# EAGLE board nest_interface_b (EAGLE 6.3)
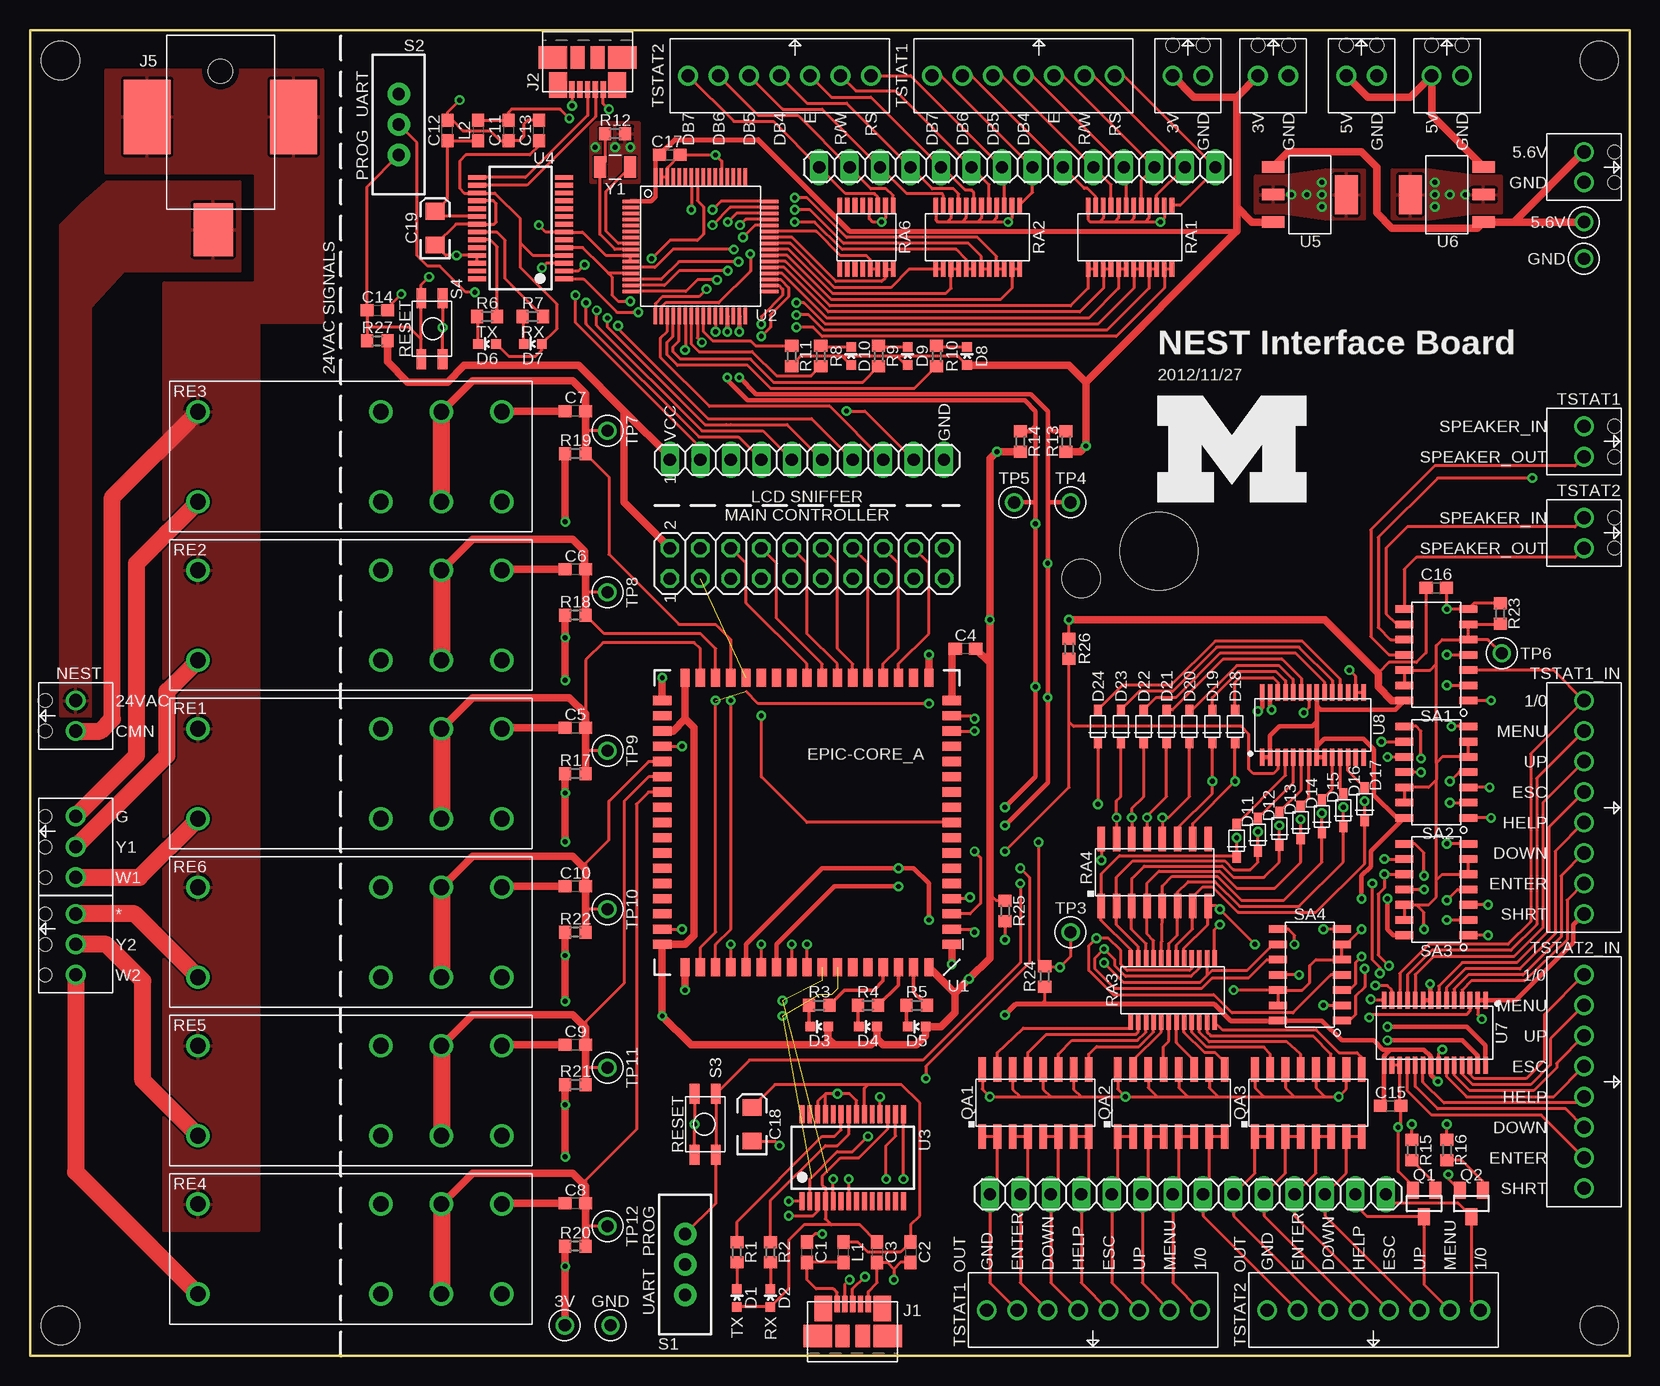
[diagram p8: board, top side]
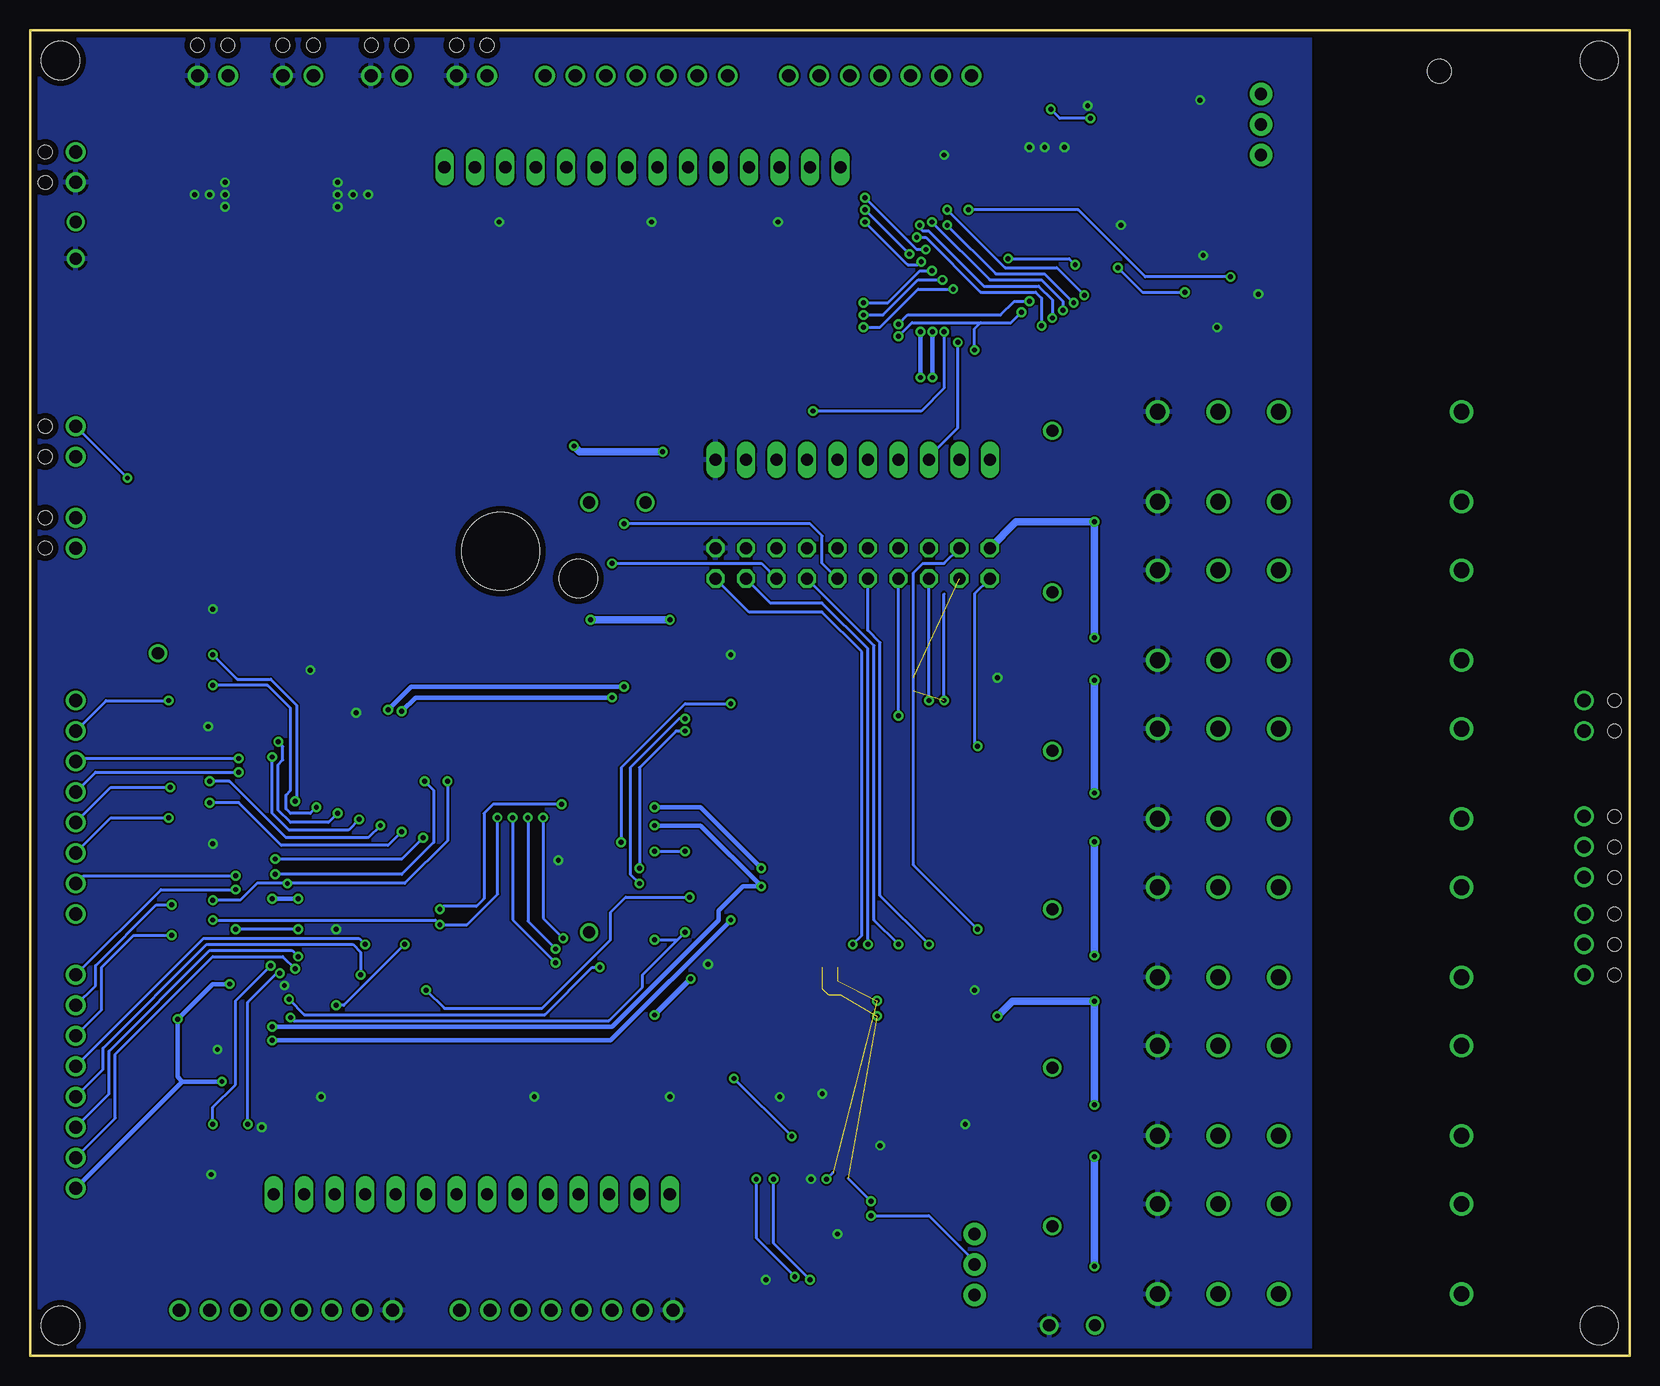
[diagram p9: board, bottom side, seen from below]

Size 133.35 x 110.49 mm. Coordinates in mm from the lower left corner, seen from the top.
Outline: 0,0 0,110.49 133.35,110.49 133.35,0 0,0
Copper layers (1*16): Top 0.0178mm / dielectric 59mil / Bottom 0.0178mm
Design rules "default": minimum track width 6mil, minimum drill 14mil, track to track 6mil, track to pad 6mil, pad to pad 6mil, via to via 6mil, smd to smd 6mil, copper to edge 20mil, drill to drill 16mil, minimum pad ring 8mil, minimum via ring 8mil, stop-mask expansion 3mil, vias tented up to drill 20mil, thermal gap 10mil
Holes 6.48 mm at 94.11,67.06
Holes 3.17 mm at 2.54,2.54 2.54,107.95 130.81,2.54 130.81,107.95 87.63,64.77

## Footprints (pad centres in the part's own frame; a part is rotated, then mirrored left to right if it is on the bottom)
C0603 = smd 1.1 x 1: 1 -0.85,0; 2 0.85,0
EIA3216 = smd 1.4 x 1.6: A 1.4,0; C -1.4,0
LED-0603 = smd 0.8 x 0.8: A 0,-0.75; C 0,0.75
SOD-323 = smd 0.889 x 0.686: P$1 -1.384,0; P$2 1.384,0
MOLEX_MICRO_USB_B_047346 = smd 1.38 x 0.45: D+ 2.66,0; D- 2.66,0.65; GND 2.66,-1.3; ID 2.66,-0.65; VCC 2.66,1.3 | smd 1.9 x 2.375: P$1 0,2.913; P$5 0,-2.913 | smd 2.1 x 1.475: P$2 2.3,2.462; P$6 2.3,-2.462 | smd 1.9 x 1.175: P$3 0,-0.838; P$4 0,0.838
2X10 = drill 1.016 octagon: 1 -11.43,-1.27; 2 -11.43,1.27; 3 -8.89,-1.27; 4 -8.89,1.27; 5 -6.35,-1.27; 6 -6.35,1.27; 7 -3.81,-1.27; 8 -3.81,1.27; 9 -1.27,-1.27; 10 -1.27,1.27; 11 1.27,-1.27; 12 1.27,1.27; 13 3.81,-1.27; 14 3.81,1.27; 15 6.35,-1.27; 16 6.35,1.27; 17 8.89,-1.27; 18 8.89,1.27; 19 11.43,-1.27; 20 11.43,1.27
PJ-0361-SMT = smd 4.4 x 3.3: 1 9.4,-0.6 | smd 6.2 x 3.9: 2 0,6.1; 3 0,-6.1 | hole 2: -3.8,0
CONN_BLOCK_2 = drill 1.1: 1 -1.27,0; 2 1.27,0 | hole 1.12: -1.27,-2.54; 1.27,-2.54
CONN_BLOCK_3 = drill 1.1: 1 -2.54,0; 2 0,0; 3 2.54,0 | hole 1.1: -2.54,-2.54; 0,-2.54; 2.54,-2.54
CONN_BLOCK_7 = drill 1.1: 1 -7.62,0; 2 -5.08,0; 3 -2.54,0; 4 0,0; 5 2.54,0; 6 5.08,0; 7 7.62,0
CONN_BLOCK_8 = drill 1.1: 1 -8.89,0; 2 -6.35,0; 3 -3.81,0; 4 -1.27,0; 5 1.27,0; 6 3.81,0; 7 6.35,0; 8 8.89,0
1X10 = drill 1.016 long: 1 -11.43,0; 2 -8.89,0; 3 -6.35,0; 4 -3.81,0; 5 -1.27,0; 6 1.27,0; 7 3.81,0; 8 6.35,0; 9 8.89,0; 10 11.43,0
1X14 = drill 1.016 long: 1 -16.51,0; 2 -13.97,0; 3 -11.43,0; 4 -8.89,0; 5 -6.35,0; 6 -3.81,0; 7 -1.27,0; 8 1.27,0; 9 3.81,0; 10 6.35,0; 11 8.89,0; 12 11.43,0; 13 13.97,0; 14 16.51,0
0603 = smd 1.1 x 1: 1 -0.85,0; 2 0.85,0
SOT23 = smd 1 x 1.4: 1 -0.95,-1.1; 2 0.95,-1.1; 3 0,1.1
SOIC-16 = smd 2.032 x 0.635: 1 -2.794,4.445; 2 -2.794,3.175; 3 -2.794,1.905; 4 -2.794,0.635; 5 -2.794,-0.635; 6 -2.794,-1.905; 7 -2.794,-3.175; 8 -2.794,-4.445; 9 2.794,-4.445; 10 2.794,-3.175; 11 2.794,-1.905; 12 2.794,-0.635; 13 2.794,0.635; 14 2.794,1.905; 15 2.794,3.175; 16 2.794,4.445
R0603 = smd 1 x 1.1: 1 -0.85,0; 2 0.85,0
LSSOP-24 = smd 0.381 x 1.27: 1 -3.493,-2.667; 2 -2.857,-2.667; 3 -2.223,-2.667; 4 -1.587,-2.667; 5 -0.953,-2.667; 6 -0.318,-2.667; 7 0.318,-2.667; 8 0.953,-2.667; 9 1.587,-2.667; 10 2.223,-2.667; 11 2.857,-2.667; 12 3.493,-2.667; 13 3.493,2.667; 14 2.857,2.667; 15 2.223,2.667; 16 1.587,2.667; 17 0.953,2.667; 18 0.318,2.667; 19 -0.318,2.667; 20 -0.953,2.667; 21 -1.587,2.667; 22 -2.223,2.667; 23 -2.857,2.667; 24 -3.493,2.667
LSSOP-16 = smd 0.381 x 1.27: 1 -2.223,-2.667; 2 -1.587,-2.667; 3 -0.953,-2.667; 4 -0.318,-2.667; 5 0.318,-2.667; 6 0.953,-2.667; 7 1.587,-2.667; 8 2.223,-2.667; 9 2.223,2.667; 10 1.587,2.667; 11 0.953,2.667; 12 0.318,2.667; 13 -0.318,2.667; 14 -0.953,2.667; 15 -1.587,2.667; 16 -2.223,2.667
S0418-CA = drill 1.3: A1 -12.67,-3.75; A2 -12.67,3.75; COMMON1 7.63,-3.75; COMMON2 7.63,3.75; NC1 2.59,-3.75; NC2 2.59,3.75; NO1 12.67,-3.75; NO2 12.67,3.75
SWITCH-SPDT = drill 1.016 pad 1.88: 1 0,2.54; 2 0,0; 3 0,-2.54
EVQP2 = smd 1.676 x 0.813: P$1 -2.54,-0.87; P$2 -2.54,0.908; P$3 2.54,-0.87; P$4 2.54,0.908
SOIC-14 = smd 0.635 x 1.524: 1 -3.81,-2.667; 2 -2.54,-2.667; 3 -1.27,-2.667; 4 0,-2.667; 5 1.27,-2.667; 6 2.54,-2.667; 7 3.81,-2.667; 8 3.81,2.667; 9 2.54,2.667; 10 1.27,2.667; 11 0,2.667; 12 -1.27,2.667; 13 -2.54,2.667; 14 -3.81,2.667
TESTPOINT_0.040IN = drill 1.016: TESTPOINT 0,0
EPIC-LCC68 = smd 1.524 x 0.762: P$1 -12.065,10.16; P$2 -12.065,8.89; P$3 -12.065,7.62; P$4 -12.065,6.35; P$5 -12.065,5.08; P$6 -12.065,3.81; P$7 -12.065,2.54; P$8 -12.065,1.27; P$9 -12.065,0; P$10 -12.065,-1.27; P$11 -12.065,-2.54; P$12 -12.065,-3.81; P$13 -12.065,-5.08; P$14 -12.065,-6.35; P$15 -12.065,-7.62; P$16 -12.065,-8.89; P$17 -12.065,-10.16; P$35 12.065,-10.16; P$36 12.065,-8.89; P$37 12.065,-7.62; P$38 12.065,-6.35; P$39 12.065,-5.08; P$40 12.065,-3.81; P$41 12.065,-2.54; P$42 12.065,-1.27; P$43 12.065,0; P$44 12.065,1.27; P$45 12.065,2.54; P$46 12.065,3.81; P$47 12.065,5.08; P$48 12.065,6.35; P$49 12.065,7.62; P$50 12.065,8.89; P$51 12.065,10.16 | smd 0.762 x 1.524: P$18 -10.16,-12.065; P$19 -8.89,-12.065; P$20 -7.62,-12.065; P$21 -6.35,-12.065; P$22 -5.08,-12.065; P$23 -3.81,-12.065; P$24 -2.54,-12.065; P$25 -1.27,-12.065; P$26 0,-12.065; P$27 1.27,-12.065; P$28 2.54,-12.065; P$29 3.81,-12.065; P$30 5.08,-12.065; P$31 6.35,-12.065; P$32 7.62,-12.065; P$33 8.89,-12.065; P$34 10.16,-12.065; P$52 10.16,12.065; P$53 8.89,12.065; P$54 7.62,12.065; P$55 6.35,12.065; P$56 5.08,12.065; P$57 3.81,12.065; P$58 2.54,12.065; P$59 1.27,12.065; P$60 0,12.065; P$61 -1.27,12.065; P$62 -2.54,12.065; P$63 -3.81,12.065; P$64 -5.08,12.065; P$65 -6.35,12.065; P$66 -7.62,12.065; P$67 -8.89,12.065; P$68 -10.16,12.065
PM/PAG64 = smd 1.4 x 0.3: 1 -5.8,3.75; 2 -5.8,3.25; 3 -5.8,2.75; 4 -5.8,2.25; 5 -5.8,1.75; 6 -5.8,1.25; 7 -5.8,0.75; 8 -5.8,0.25; 9 -5.8,-0.25; 10 -5.8,-0.75; 11 -5.8,-1.25; 12 -5.8,-1.75; 13 -5.8,-2.25; 14 -5.8,-2.75; 15 -5.8,-3.25; 16 -5.8,-3.75; 33 5.8,-3.75; 34 5.8,-3.25; 35 5.8,-2.75; 36 5.8,-2.25; 37 5.8,-1.75; 38 5.8,-1.25; 39 5.8,-0.75; 40 5.8,-0.25; 41 5.8,0.25; 42 5.8,0.75; 43 5.8,1.25; 44 5.8,1.75; 45 5.8,2.25; 46 5.8,2.75; 47 5.8,3.25; 48 5.8,3.75 | smd 0.3 x 1.4: 17 -3.75,-5.8; 18 -3.25,-5.8; 19 -2.75,-5.8; 20 -2.25,-5.8; 21 -1.75,-5.8; 22 -1.25,-5.8; 23 -0.75,-5.8; 24 -0.25,-5.8; 25 0.25,-5.8; 26 0.75,-5.8; 27 1.25,-5.8; 28 1.75,-5.8; 29 2.25,-5.8; 30 2.75,-5.8; 31 3.25,-5.8; 32 3.75,-5.8; 49 3.75,5.8; 50 3.25,5.8; 51 2.75,5.8; 52 2.25,5.8; 53 1.75,5.8; 54 1.25,5.8; 55 0.75,5.8; 56 0.25,5.8; 57 -0.25,5.8; 58 -0.75,5.8; 59 -1.25,5.8; 60 -1.75,5.8; 61 -2.25,5.8; 62 -2.75,5.8; 63 -3.25,5.8; 64 -3.75,5.8
SSOP28 = smd 0.4 x 1.5: 1 -4.225,-3.625; 2 -3.575,-3.625; 3 -2.925,-3.625; 4 -2.275,-3.625; 5 -1.625,-3.625; 6 -0.975,-3.625; 7 -0.325,-3.625; 8 0.325,-3.625; 9 0.975,-3.625; 10 1.625,-3.625; 11 2.275,-3.625; 12 2.925,-3.625; 13 3.575,-3.625; 14 4.225,-3.625; 15 4.225,3.625; 16 3.575,3.625; 17 2.925,3.625; 18 2.275,3.625; 19 1.625,3.625; 20 0.975,3.625; 21 0.325,3.625; 22 -0.325,3.625; 23 -0.975,3.625; 24 -1.625,3.625; 25 -2.275,3.625; 26 -2.925,3.625; 27 -3.575,3.625; 28 -4.225,3.625
SOT-223-3 = smd 0.95 x 1.9: 1 -2.3,-3.05; 2 0,-3.05; 3 2.3,-3.05 | smd 3.25 x 1.9: 4 0,3.05
TSSOP28 = smd 0.38 x 1.4: 1 -4.225,-2.7; 2 -3.575,-2.7; 3 -2.925,-2.7; 4 -2.275,-2.7; 5 -1.625,-2.7; 6 -0.975,-2.7; 7 -0.325,-2.7; 8 0.325,-2.7; 9 0.975,-2.7; 10 1.625,-2.7; 11 2.275,-2.7; 12 2.925,-2.7; 13 3.575,-2.7; 14 4.225,-2.7; 15 4.225,2.7; 16 3.575,2.7; 17 2.925,2.7; 18 2.275,2.7; 19 1.625,2.7; 20 0.975,2.7; 21 0.325,2.7; 22 -0.325,2.7; 23 -0.975,2.7; 24 -1.625,2.7; 25 -2.275,2.7; 26 -2.925,2.7; 27 -3.575,2.7; 28 -4.225,2.7
FC-135 = smd 1 x 1.8: 1 -1.25,0; 2 1.25,0

## Placement (x,y rotation side)
C1  0.1u  [C0603]  64.77,8.64 90 top
C2  0.1u  [C0603]  73.41,8.64 270 top
C3  0.1u  [C0603]  70.61,8.64 270 top
C4  0.1u  [C0603]  77.98,58.93 180 top
C5  0.1u  [C0603]  45.47,52.32 180 top
C6  0.1u  [C0603]  45.47,65.53 180 top
C7  0.1u  [C0603]  45.47,78.74 180 top
C8  0.1u  [C0603]  45.47,12.7 180 top
C9  0.1u  [C0603]  45.47,25.91 180 top
C10  0.1u  [C0603]  45.47,39.12 180 top
C11  0.1u  [C0603]  39.88,102.11 270 top
C12  0.1u  [C0603]  34.8,102.11 90 top
C13  0.1u  [C0603]  42.42,102.11 90 top
C14  0.1u  [C0603]  28.96,87.12 0 top
C15  0.1u  [C0603]  113.41,20.83 0 top
C16  0.1u  [C0603]  117.22,64.01 0 top
C17  1u  [C0603]  53.34,100.08 0 top
C18  10u  [EIA3216]  60.2,19.3 90 top
C19  10u  [EIA3216]  33.78,93.98 90 top
D1  RED  [LED-0603]  58.93,4.83 0 top
D2  BLUE  [LED-0603]  61.72,4.83 0 top
D3  RED  [LED-0603]  65.79,27.43 90 top
D4  GREEN  [LED-0603]  69.85,27.43 90 top
D5  BLUE  [LED-0603]  73.91,27.43 90 top
D6  RED  [LED-0603]  38.1,84.33 90 top
D7  BLUE  [LED-0603]  41.91,84.33 90 top
D8  RED  [LED-0603]  78.11,83.31 0 top
D9  GREEN  [LED-0603]  73.15,83.31 0 top
D10  BLUE  [LED-0603]  68.45,83.31 0 top
D11  B5818WS-SCHOTTKY-DIODE  [SOD-323]  100.58,42.93 270 top
D12  B5818WS-SCHOTTKY-DIODE  [SOD-323]  102.36,43.43 270 top
D13  B5818WS-SCHOTTKY-DIODE  [SOD-323]  104.14,43.94 270 top
D14  B5818WS-SCHOTTKY-DIODE  [SOD-323]  105.92,44.45 270 top
D15  B5818WS-SCHOTTKY-DIODE  [SOD-323]  107.7,44.96 270 top
D16  B5818WS-SCHOTTKY-DIODE  [SOD-323]  109.47,45.47 270 top
D17  B5818WS-SCHOTTKY-DIODE  [SOD-323]  111.25,45.97 270 top
D18  B5818WS-SCHOTTKY-DIODE  [SOD-323]  100.46,52.45 270 top
D19  B5818WS-SCHOTTKY-DIODE  [SOD-323]  98.55,52.45 270 top
D20  B5818WS-SCHOTTKY-DIODE  [SOD-323]  96.65,52.45 270 top
D21  B5818WS-SCHOTTKY-DIODE  [SOD-323]  94.74,52.45 270 top
D22  B5818WS-SCHOTTKY-DIODE  [SOD-323]  92.84,52.45 270 top
D23  B5818WS-SCHOTTKY-DIODE  [SOD-323]  90.93,52.45 270 top
D24  B5818WS-SCHOTTKY-DIODE  [SOD-323]  89.03,52.45 270 top
J1  MOLEX_MICRO_USB_B_047346  [MOLEX_MICRO_USB_B_047346]  68.58,1.65 90 top
J2  MOLEX_MICRO_USB_B_047346  [MOLEX_MICRO_USB_B_047346]  46.48,108.2 270 top
J3  [2X10]  64.77,66.04 0 top
J5  PJ-036A-SMT  [PJ-0361-SMT]  15.88,103.25 270 top
J6  CONN_BLOCK_2  [CONN_BLOCK_2]  3.81,53.34 270 top
J7  CONN_BLOCK_2  [CONN_BLOCK_2]  129.54,99.06 90 top
J8  CONN_BLOCK_2  [CONN_BLOCK_2]  111,106.68 180 top
J9  CONN_BLOCK_2  [CONN_BLOCK_2]  118.11,106.68 180 top
J10  CONN_BLOCK_2  [CONN_BLOCK_2]  96.52,106.68 180 top
J11  CONN_BLOCK_2  [CONN_BLOCK_2]  103.63,106.68 180 top
J12  CONN_BLOCK_2  [CONN_BLOCK_2]  129.54,76.2 90 top
J13  CONN_BLOCK_2  [CONN_BLOCK_2]  129.54,68.58 90 top
J14  CONN_BLOCK_3  [CONN_BLOCK_3]  3.81,42.42 270 top
J15  CONN_BLOCK_3  [CONN_BLOCK_3]  3.81,34.29 270 top
J16  CONN_BLOCK_7  [CONN_BLOCK_7]  82.8,106.68 180 top
J17  CONN_BLOCK_7  [CONN_BLOCK_7]  62.48,106.68 180 top
J18  CONN_BLOCK_8  [CONN_BLOCK_8]  129.54,45.72 90 top
J19  CONN_BLOCK_8  [CONN_BLOCK_8]  129.54,22.86 90 top
J20  CONN_BLOCK_8  [CONN_BLOCK_8]  88.65,3.81 0 top
J21  CONN_BLOCK_8  [CONN_BLOCK_8]  112.01,3.81 0 top
JP1  [1X10]  64.77,74.68 0 top
JP2  [1X14]  82.3,99.06 0 top
JP3  [1X14]  96.52,13.46 0 top
L1  [0603]  67.82,8.64 90 top
L2  [0603]  37.34,102.11 270 top
Q1  [SOT23]  116.2,12.7 180 top
Q2  [SOT23]  120.14,12.7 180 top
QA1  MMPQ2222A  [SOIC-16]  83.82,21.08 90 top
QA2  MMPQ2222A  [SOIC-16]  95.12,21.08 90 top
QA3  MMPQ2222A  [SOIC-16]  106.55,21.08 90 top
R1  240  [R0603]  58.93,8.64 270 top
R2  240  [R0603]  61.72,8.64 270 top
R3  240  [R0603]  65.79,29.21 180 top
R4  240  [R0603]  69.85,29.21 180 top
R5  240  [R0603]  73.91,29.21 180 top
R6  240  [R0603]  38.1,86.61 180 top
R7  240  [R0603]  41.91,86.61 180 top
R8  240  [R0603]  65.91,83.31 90 top
R9  240  [R0603]  70.74,83.31 90 top
R10  240  [R0603]  75.56,83.31 90 top
R11  100k 0.1%  [R0603]  63.5,83.31 90 top
R12  5.1M  [R0603]  48.77,101.85 180 top
R13  10k  [R0603]  86.36,76.2 90 top
R14  10k  [R0603]  82.55,76.2 90 top
R15  10k  [R0603]  115.19,17.14 90 top
R16  10k  [R0603]  118.11,17.14 90 top
R17  100k  [R0603]  45.47,48.51 180 top
R18  100k  [R0603]  45.47,61.72 180 top
R19  100k  [R0603]  45.47,75.18 180 top
R20  100k  [R0603]  45.47,9.14 180 top
R21  100k  [R0603]  45.47,22.61 180 top
R22  100k  [R0603]  45.47,35.31 180 top
R23  100k  [R0603]  122.56,61.85 90 top
R24  100k  [R0603]  84.58,31.62 90 top
R25  100k  [R0603]  81.28,37.08 270 top
R26  100k  [R0603]  86.61,58.93 270 top
R27  100k  [R0603]  28.96,84.58 180 top
RA1  VSSR2403103  [LSSOP-24]  91.69,93.22 180 top
RA2  VSSR2403103  [LSSOP-24]  78.99,93.22 180 top
RA3  VSSR2403103  [LSSOP-24]  95.25,30.48 180 top
RA4  766161104GP  [SOIC-16]  93.75,40.28 90 top
RA6  VSSR1603103  [LSSOP-16]  69.72,93.22 180 top
RE1  RT314524  [S0418-CA]  26.67,48.51 0 top
RE2  RT314524  [S0418-CA]  26.67,61.72 0 top
RE3  RT314524  [S0418-CA]  26.67,74.93 0 top
RE4  RT314524  [S0418-CA]  26.67,8.89 0 top
RE5  RT314524  [S0418-CA]  26.67,22.1 0 top
RE6  RT314524  [S0418-CA]  26.67,35.31 0 top
S1  [SWITCH-SPDT]  54.61,7.62 0 top
S2  [SWITCH-SPDT]  30.73,102.62 180 top
S3  EVQP2  [EVQP2]  56.26,19.3 270 top
S4  EVQP2  [EVQP2]  33.53,85.6 90 top
SA1  TS12A44515DR  [SOIC-14]  117.22,58.42 90 top
SA2  TS12A44515DR  [SOIC-14]  117.22,48.64 90 top
SA3  TS12A44515DR  [SOIC-14]  117.22,38.86 90 top
SA4  TS12A44515DR  [SOIC-14]  106.68,31.75 90 top
TP1  TEST_POINT_0.040IN  [TESTPOINT_0.040IN]  44.58,2.54 0 top
TP2  TEST_POINT_0.040IN  [TESTPOINT_0.040IN]  48.39,2.54 0 top
TP3  TEST_POINT_0.040IN  [TESTPOINT_0.040IN]  86.74,35.31 0 top
TP4  TEST_POINT_0.040IN  [TESTPOINT_0.040IN]  86.74,71.12 0 top
TP5  TEST_POINT_0.040IN  [TESTPOINT_0.040IN]  82.04,71.12 0 top
TP6  TEST_POINT_0.040IN  [TESTPOINT_0.040IN]  122.68,58.55 0 top
TP7  TEST_POINT_0.040IN  [TESTPOINT_0.040IN]  48.13,77.09 0 top
TP8  TEST_POINT_0.040IN  [TESTPOINT_0.040IN]  48.13,63.63 0 top
TP9  TEST_POINT_0.040IN  [TESTPOINT_0.040IN]  48.13,50.42 0 top
TP10  TEST_POINT_0.040IN  [TESTPOINT_0.040IN]  48.13,37.21 0 top
TP11  TEST_POINT_0.040IN  [TESTPOINT_0.040IN]  48.13,24 0 top
TP12  TEST_POINT_0.040IN  [TESTPOINT_0.040IN]  48.13,10.79 0 top
TP13  TEST_POINT_0.040IN  [TESTPOINT_0.040IN]  129.54,94.49 0 top
TP14  TEST_POINT_0.040IN  [TESTPOINT_0.040IN]  129.54,91.44 0 top
U1  EPIC-CORE_A  [EPIC-LCC68]  64.77,44.45 180 top
U2  MSP430F1611IPM  [PM/PAG64]  55.88,92.46 0 top
U3  FT232RL  [SSOP28]  68.58,16.51 0 top
U4  FT232RL  [SSOP28]  40.89,93.98 90 top
U5  MPC1825  [SOT-223-3]  106.68,96.77 270 top
U6  TC1262  [SOT-223-3]  118.11,96.77 90 top
U7  PCA9575  [TSSOP28]  117.09,26.92 180 top
U8  PCA9575  [TSSOP28]  106.93,52.58 0 top
U$1  UMICH_SOLID_LARGE  [UMICH_SOLID_350MIL]  93.98,71.12 0 top
Y1  FC-135_32.768KA-A3  [FC-135]  48.77,99.06 180 top

## Tracks (layer width: path | path; a pad name or v marks a point on that pad's centre or on a via)
5.6V_SUPPLY
  Top 0.61: U5.1 104.89,100.33 111,100.33 112.27,99.06 112.27,95.25 113.54,93.98 120.67,93.98 U6.1 123.68,94.47 | 123.68,94.47 J7.2 | TP13.TESTPOINT 123.68,94.47
5V
  Top 0.61: J8.2 111.51,104.9 115.06,104.9 J9.2 116.84,103.39 U6.3
#KEYPAD_ENABLE  (via drill 0.41)
  Top 0.254: U1.P$4 78.11,38.1 v78.36,38.23 | SA3.13 SA3.12 115.57,37.59 | 115.57,37.59 116.59,37.59 117.22,38.23 117.22,39.62 | 117.22,39.62 117.73,40.13 SA3.5 SA3.6 | SA2.6 SA2.5 117.73,49.91 117.22,49.4 | 117.22,49.4 117.22,48.01 | 117.22,48.01 116.59,47.37 SA2.12 SA2.13 | SA1.13 SA1.12 116.71,57.15 117.22,57.66 | 117.22,57.66 117.22,59.18 117.73,59.69 SA1.5 | SA1.5 SA1.6 122.52,60.96 R23.1 | 117.22,39.62 117.22,48.01 | 117.22,49.4 117.22,57.66 | SA4.12 SA4.13 | SA4.12 106.05,30.48 106.68,31.11 106.68,32.51 107.19,33.02 SA4.5 SA4.6 109.73,34.29 v111,35.56 | SA4.12 v100.33,30.48 | v116.2,35.56 116.2,36.96 115.57,37.59 | TP6.TESTPOINT 121.54,59.69 SA1.5
  Bottom 0.254: v111,35.56 v116.2,35.56 | v100.33,30.48 98.81,28.96 90.68,28.96 84.96,34.67 84.96,36.96 83.69,38.23 v78.36,38.23
COMMON
  Top 1.422: J6.2 5.84,52.07 6.86,53.09 6.86,71.54 RE3.A2
  pour Top: 6.35,98.55 6.35,107.19 24.38,107.19 24.38,86.11 19.05,86.11 19.05,10.41 11.18,10.41 11.18,89.41 18.8,89.41 18.8,98.55
COOLING1_PIN
  Top 0.254: U1.P$32 57.15,58.93 55.88,60.2 47.84,60.2 R18.1 | TP8.TESTPOINT 46.44,63.63 46.32,63.5
  Top 0.61: RE2.COMMON2 36.9,68.07 45.21,68.07 46.23,67.06 46.23,65.62 C6.1 46.32,63.5 R18.1
  Top 1.422: RE2.COMMON2 RE2.COMMON1
COOLING2_PIN
  Top 0.254: U1.P$40 51.56,48.26 49.53,46.23 49.53,31.07 46.32,27.85 46.32,27.34 | TP11.TESTPOINT 46.44,24 46.32,23.88
  Top 0.61: RE5.COMMON2 36.9,28.45 45.21,28.45 46.32,27.34 C9.1 46.32,23.88 R21.1
  Top 1.422: RE5.COMMON2 RE5.COMMON1
EPIC_ADC1
  Top 0.254: U1.P$20 72.39,57.66 74.93,60.2 74.93,66.04 J3.18
EPIC_ADC2
  Top 0.254: U1.P$21 71.12,57.66 72.39,58.93 72.39,66.04 J3.16
EPIC_ADC3
  Top 0.254: U1.P$22 69.85,66.04 J3.14
EPIC_ADC4
  Top 0.254: U1.P$23 68.58,57.66 67.31,58.93 67.31,66.04 J3.12
EPIC_ADC5
  Top 0.254: U1.P$24 67.31,57.66 64.77,60.2 64.77,66.04 J3.10
EPIC_ADC6/DAC0
  Top 0.254: U1.P$25 66.04,57.66 62.23,61.47 62.23,66.04 J3.8
EPIC_ADC7/DAC1
  Top 0.254: U1.P$26 64.77,57.66 59.69,62.74 59.69,66.04 J3.6
EPIC_MISO0  (via drill 0.41)
  Top 0.254: U1.P$57 v60.96,34.29
  Bottom 0.254: v60.96,34.29 62.99,36.32 62.99,59.18 J3.13
EPIC_P1.2  (1 unrouted)
EPIC_P2.0  (via drill 0.41)
  Top 0.254: U1.P$38 v54.36,50.8
  Bottom 0.254: J3.1 54.61,63.5 54.61,51.05 v54.36,50.8
EPIC_P2.4  (via drill 0.41)
  Top 0.254: U1.P$54 57.15,34.29 58.42,35.56 v58.42,54.61
  Bottom 0.254: v58.42,54.61 J3.5
EPIC_P5.7  (via drill 0.41 pad 0.41)
  Top 0.254: U1.P$9 64.77,44.45 60.96,48.26 v60.96,53.34
  Bottom 0.254: v60.96,53.34 J3.7
EPIC_STE0  (via drill 0.41)
  Top 0.254: U1.P$55 v58.42,34.29
  Bottom 0.254: v58.42,34.29 62.48,38.35 62.48,59.44 63.5,60.45 J3.9
EPIC_UART0RX  (via drill 0.41)
  Top 0.254: U1.P$60 v64.77,34.29
  Bottom 0.254: v64.77,34.29 64.01,35.05 64.01,58.67 67.31,61.98 73.41,61.98 J3.19
EPIC_UART0TX  (via drill 0.41)
  Top 0.254: U1.P$59 v63.5,34.29
  Bottom 0.254: v63.5,34.29 63.5,58.93 67.31,62.74 71.63,62.74 J3.17
FAN_PIN
  Top 0.254: U1.P$31 58.42,59.69 57.15,60.96 54.1,60.96 48.26,66.8 48.26,73.24 R19.1 | TP7.TESTPOINT 46.32,77.09
  Top 0.61: RE3.COMMON2 36.9,81.28 45.21,81.28 46.32,80.18 C7.1 46.32,77.09 R19.1
  Top 1.422: RE3.COMMON1 RE3.COMMON2
G
  Top 1.422: RE3.A1 11.43,68.61 11.43,68.58 8.89,66.04 8.89,50.04 J14.1
GND  (via drill 0.41, 0.41 pad 0.41)
  Top 0.254: J1.GND 69.88,5.36 70.61,6.1 C3.2 71.46,7.79 72.01,7.24 | U3.25 66.29,21.84 | U3.7 v68.25,14.73 | S3.P$3 v55.39,19.3 S3.P$1 | v66.04,10.16 65.44,10.16 C1.2 | C2.2 72.56,7.79 72.01,7.24 | 72.01,7.24 v72.01,6.35 | U3.18 v70.86,21.58 | U3.21 68.91,21.27 68.33,21.84 v67.31,21.84 66.29,21.84 | 66.29,21.84 65.66,21.2 U3.26 | RA1.2 94.55,94.81 v94.23,94.49 92.96,94.49 | 92.96,94.49 91.69,94.49 | 91.69,94.49 90.42,94.49 | 90.42,94.49 89.15,94.49 | 89.15,94.49 88.39,94.49 88.2,94.68 RA1.12 | RA1.10 89.47,94.81 89.15,94.49 | RA1.8 90.74,94.81 90.42,94.49 | RA1.6 92.01,94.81 91.69,94.49 | RA1.4 93.28,94.81 92.96,94.49 | RA2.2 81.85,94.81 v81.53,94.49 80.26,94.49 | 80.26,94.49 78.99,94.49 | 78.99,94.49 77.72,94.49 | 77.72,94.49 76.45,94.49 | 76.45,94.49 75.69,94.49 75.5,94.68 RA2.12 | RA2.10 76.77,94.81 76.45,94.49 | RA2.8 78.04,94.81 77.72,94.49 | RA2.6 79.31,94.81 78.99,94.49 | RA2.4 80.58,94.81 80.26,94.49 | RA6.2 71.31,94.81 v70.99,94.49 70.23,94.49 69.98,94.74 69.98,95.82 RA6.4 | J2.GND v45.18,104.17 | C18.C 62.11,17.9 v62.48,17.53 | S4.P$3 v34.4,85.71 S4.P$1 | U4.18 38.61,96.27 38.86,96.01 38.86,94.49 38.68,94.31 U4.21 35.51,94.31 C19.C 34.66,91.7 v35.56,91.7 U4.25 U4.26 | U2.11 U2.10 47.99,91.71 46.05,93.66 U4.7 43,93.66 v42.42,94.23 | U2.63 U2.62 53.13,99.02 C17.2 v57.15,100.08 57.66,99.57 57.66,98.28 U2.53 | C13.2 41.49,102.96 41.15,102.62 41.15,101.6 40.81,101.26 C11.2 39.2,101.26 38.35,102.11 36.07,102.11 35.22,102.96 C12.2 34.8,103.63 v35.81,104.65 | C14.2 29.81,87.34 v30.95,88.48 | SA2.7 v118.49,52.45 | U8.15 U8.16 110.51,56.62 v109.98,57.15 | SA3.7 v118.11,42.67 | SA4.7 v107.82,35.56 | QA1.16 79.38,22.23 v80.01,21.59 82.55,21.59
  Top 0.254: 82.55,21.59 85.09,21.59 | 85.09,21.59 87.63,21.59 | 87.63,21.59 v91.31,21.59 | v91.31,21.59 93.98,21.59 | 93.98,21.59 96.52,21.59 | 96.52,21.59 99.06,21.59 | 99.06,21.59 102.87,21.59 | 102.87,21.59 105.41,21.59 | 105.41,21.59 107.95,21.59 | 107.95,21.59 v109.09,21.59 109.73,22.23 QA3.10 | QA1.14 81.92,22.23 82.55,21.59 | QA1.12 84.45,22.23 85.09,21.59 | QA1.10 87,22.23 87.63,21.59 | QA2.16 90.68,22.23 v91.31,21.59 | QA2.14 93.22,22.35 93.98,21.59 | QA2.12 95.76,22.35 96.52,21.59 | QA2.10 98.3,22.35 99.06,21.59 | QA3.16 102.11,22.35 102.87,21.59 | QA3.14 104.65,22.35 105.41,21.59 | QA3.12 107.19,22.35 107.95,21.59 | U7.17 114.17,20.92 C15.2 | U7.17 | U7.17 U7.16 | U7.22 117.42,25.22 v117.73,25.53 | U7.13 113.52,30.5 113.16,30.86 v112.14,30.86 | U8.22 106.61,54.03 v106.17,53.59 | RA4.16 v89.31,41.3 | R23.2 120.36,62.7 SA1.7 v118.11,62.23 118.07,62.27 C16.2 | 114.3,20.79 C15.2 | C15.2 114.26,19.27 v114.05,19.05 114.05,15.37 115.25,14.16 Q1.2 | Q2.2 118.24,14.76 v118.24,15.11
  Top 0.61: RE3.NO2 39.4,78.74 C7.2 | RE2.NO2 39.4,65.53 C6.2 | RE1.NO2 39.4,52.32 C5.2 | U1.P$52 v54.61,30.48 | U1.P$35 v52.7,56.52 | U1.P$18 v74.93,58.42 | U1.P$1 v76.83,32.64 | C10.2 39.4,39.12 RE6.NO2 | C9.2 39.4,25.91 RE5.NO2 | C8.2 39.4,12.7 RE4.NO2
  other vias: 107.7,95.76 107.7,96.77 107.7,97.79 106.43,96.77 105.16,96.77 117.09,95.76 117.09,96.77 117.09,97.79 118.36,96.77 119.63,96.77 48.77,100.71 50.04,100.71 47.12,100.71
  pour Bottom: 26.67,0 26.67,110.49 133.35,110.49 133.35,0
  pour Top: 111.25,94.74 111.25,98.81 107.95,98.81 104.39,98.3 102.11,98.3 102.11,95.25 104.39,95.25 107.95,94.74
  pour Top: 113.54,98.81 113.54,94.74 116.84,94.74 120.4,95.25 122.68,95.25 122.68,98.3 120.4,98.3 116.84,98.81
  pour Top: 46.74,102.74 46.74,97.79 50.8,97.79 50.8,102.74
HEATING1_PIN
  Top 0.254: U1.P$33 55.88,58.93 55.37,59.44 47.75,59.44 46.32,58 46.32,53.34 | TP9.TESTPOINT 46.44,50.42 46.32,50.29
  Top 0.61: RE1.COMMON2 36.9,54.86 44.96,54.86 46.32,53.51 46.32,53.34 C5.1 46.32,50.29 R17.1
  Top 1.422: RE1.COMMON2 RE1.COMMON1
HEATING2_PIN
  Top 0.254: U1.P$41 51.56,46.99 50.55,45.97 50.55,18.87 46.32,14.64 46.32,13.97 | TP12.TESTPOINT 46.44,10.79 46.32,10.67
  Top 0.61: RE4.COMMON2 36.9,15.24 45.21,15.24 46.32,14.14 46.32,13.97 C8.1 46.32,10.67 R20.1
  Top 1.422: RE4.COMMON2 RE4.COMMON1
I2C_SCL  (via drill 0.41, 0.41 pad 0.41)
  Top 0.356: U2.31 v59.13,85.34 | 84.84,77.47 84.84,78.74 83.44,80.14 60.53,80.14 v59.13,81.53 | 84.84,77.47 84.84,71.12 | 84.84,71.12 v84.84,66.04 v84.84,54.86 84.84,47.75 v81.28,44.2 | v72.39,39.12 67.06,39.12 62.23,34.29 U1.P$58 | R13.2 85.26,77.05 84.84,77.47 | U8.28 102.71,54.07 v102.36,53.72 | U7.28 121.32,25.87 119.76,27.43 v113.16,27.43 | TP4.TESTPOINT 84.84,71.12
  Bottom 0.254: v84.84,66.04 72.39,66.04 J3.15
  Bottom 0.356: v59.13,85.34 v59.13,81.53 | v81.28,44.2 77.47,44.2 v72.39,39.12 73.91,39.12 75.95,37.08 75.95,36.32 84.84,27.43 v113.16,27.43 | v102.36,53.72 101.22,54.86 v84.84,54.86
I2C_SDA  (via drill 0.41, 0.41 pad 0.41)
  Top 0.356: U2.29 v58.13,85.34 | v58.13,81.53 58.13,81.32 59.82,79.63 82.93,79.63 83.82,78.74 83.82,77.47 | 83.82,77.47 83.82,71.12 | 83.82,71.12 v83.82,69.34 v83.82,55.75 83.82,48.26 v81.28,45.72 | U1.P$56 59.69,34.29 66.04,40.64 v72.39,40.64 73.66,40.64 74.93,39.37 v74.93,36.32 | R14.2 83.4,77.05 83.82,77.47 | U8.27 103.36,53.99 v103.5,53.85 | U7.27 120.67,25 119.38,26.29 v113.16,26.29 | TP5.TESTPOINT 83.82,71.12
  Bottom 0.254: J3.11 67.31,66.04 67.31,68.33 68.33,69.34 v83.82,69.34
  Bottom 0.356: v58.13,85.34 v58.13,81.53 | v72.39,40.64 77.47,45.72 v81.28,45.72 | v103.5,53.85 101.6,55.75 v83.82,55.75 | v113.16,26.29 84.96,26.29 v74.93,36.32
LCDP_MISO1  (via drill 0.41 pad 0.41)
  Top 0.254: U2.46 58.88,95.21 v58.17,94.49 | JP1.5 61.09,77.09 58.42,77.09 57.78,77.09 56.01,77.09 47.24,85.85 v47.24,87.12
  Bottom 0.254: v58.17,94.49 53.34,89.66 49.02,89.66 47.24,87.88 v47.24,87.12
LCDP_MOSI1  (via drill 0.41 pad 0.41)
  Top 0.254: U2.45 59.65,94.71 v59.18,94.23 | JP1.6 63.12,77.6 58.42,77.6 58.04,77.6 56.26,77.6 48.13,85.72 v48.13,86.49
  Bottom 0.254: v59.18,94.23 59.18,93.98 58.93,93.73 58.42,93.73 53.85,89.15 49.28,89.15 48.13,88.01 v48.13,86.49
LCDP_P1.7
  Top 0.254: JP1.8 66.67,79.12 56.64,79.12 52.58,83.19 52.58,84.84 53.13,85.39 U2.19
LCDP_P2.3
  Top 0.254: R8.1 65.11,81.66 62.23,81.66 60.2,83.69 55.75,83.69 55.12,84.33 55.12,86.64 U2.23
LCDP_P2.4  (via drill 0.41)
  Top 0.254: U2.24 55.63,84.83 v56.01,84.45
  Bottom 0.254: v56.01,84.45 56.01,77.34 58.42,74.93 JP1.3
LCDP_P2.7  (via drill 0.41)
  Top 0.254: U2.27 57.13,85.49 v57.15,85.34 | v68.07,78.74 69.6,78.74 JP1.9
  Bottom 0.254: v57.15,85.34 57.15,80.64 59.05,78.74 v68.07,78.74
LCDP_P5.4  (via drill 0.41)
  Top 0.254: U2.48 57.6,96.21 v56.9,95.5 | v45.47,88.39 45.47,86.11 55.88,75.69 JP1.2
  Bottom 0.254: v56.9,95.5 52.07,90.68 47.75,90.68 v45.47,88.39
LCDP_STE1  (via drill 0.41 pad 0.41)
  Top 0.254: U2.44 60.42,94.21 v59.44,93.22 | JP1.7 65.15,78.11 56.52,78.11 49.02,85.6 v49.02,85.85
  Bottom 0.254: v59.44,93.22 58.67,93.22 54.1,88.65 49.53,88.65 49.02,88.14 v49.02,85.85
LCDP_UART1RX  (via drill 0.41)
  Top 0.254: U4.1 46.13,89.75 48.93,86.96 v50.71,86.96 | v60.96,84.96 61.72,85.72 61.72,86.74 63.25,88.27 63.25,89.03 62.57,89.71 U2.35 | U2.22 54.63,83.97 v54.61,83.82
  Bottom 0.254: v60.96,84.96 59.82,86.11 54.1,86.11 | 54.1,86.11 51.56,86.11 v50.71,86.96 | v54.61,83.82 54.61,85.6 54.1,86.11
LCDP_UART1TX  (via drill 0.41)
  Top 0.254: 48.22,90.21 48.51,89.92 48.51,88.39 49.02,87.88 v50.04,87.88 | U4.5 46.08,92.36 47.62,90.81 48.22,90.21 | U2.34 62.43,89.21 62.74,88.9 62.74,88.39 60.96,86.61 v60.96,85.98 | U2.13 48.22,90.21
  Bottom 0.254: v60.96,85.98 60.2,86.74 52.45,86.74 51.31,87.88 v50.04,87.88
LCDP_UCLK1  (via drill 0.41 pad 0.41)
  Top 0.254: U2.47 58.37,95.71 v56.9,94.23 | JP1.4 59.05,76.58 55.75,76.58 46.35,85.98 v46.35,87.76
  Bottom 0.254: v56.9,94.23 52.83,90.17 48.77,90.17 v46.35,87.76
N$1
  Top 0.254: J1.VCC 67.28,5.28 66.97,5.59 65.53,5.59 64.77,6.35 C1.1 L1.1
N$2
  Top 0.254: R1.2 D1.C
N$3  (via drill 0.41)
  Top 0.254: v71.37,14.73 71.37,17.53 72.16,18.31 U3.16 | J1.D- 67.93,5.95 v68.33,6.35
  Bottom 0.254: v71.37,14.73 71.37,9.4 v68.33,6.35
N$4  (via drill 0.41)
  Top 0.254: v72.81,14.73 U3.15 | J1.D+ 68.58,5.59 v69.6,6.6
  Bottom 0.254: v72.81,14.73 72.81,9.81 v69.6,6.6
N$6
  Top 0.254: L1.2 69,9.49 69.85,8.64 72.56,8.64 C2.1 73.41,10.92 74.17,11.68 74.17,21.08 72.64,22.61 69.85,22.61 | 69.85,22.61 62.1,22.61 C18.A | U3.20 69.56,22.31 69.85,22.61
N$7
  Top 0.254: R2.2 D2.C
N$8
  Top 0.254: R10.1 73.75,80.64 61.72,80.64 59.82,82.55 53.98,82.55 53.09,83.44 53.09,84.45 53.59,84.96 53.59,86.62 U2.20
N$9  (via drill 0.41)  (5 unrouted)
  Top 0.254: U3.1 v63.25,12.88
  Bottom 0.254: 65.15,14.79 v63.25,12.88
  other vias: 62.74,28.32
N$10
  Top 0.254: R1.1 58.93,11.18 66.04,18.29 67.06,18.29 67.61,18.84 U3.23
N$11
  Top 0.254: R2.1 61.72,12.95 66.29,17.53 67.31,17.53 68.25,18.47 U3.22
N$12  (via drill 0.41)  (3 unrouted)
  Top 0.254: U3.5 v66.95,14.73
  Bottom 0.254: 66.42,15.27 v66.95,14.73
  other vias: 62.74,29.59
N$13
  Top 0.254: D8.C 76.05,84.06 R10.2
N$14  (via drill 0.41, 0.41 pad 0.41)
  Top 0.254: U3.2 65,14.73 67.29,17.02 68.58,17.02 v69.85,18.29 | U1.P$15 v78.74,52.07 | v82.55,40.64 83.31,39.88 83.31,32.77 74.68,24.13 v74.68,23.11
  Bottom 0.254: v69.85,18.29 v74.68,23.11 | v78.74,52.07 79.5,52.07 82.55,49.02 v82.55,40.64
N$15
  Top 0.254: D1.A D2.A 63.25,5.6 63.25,9.65 64.52,10.92 66.8,10.92 | C3.1 69.18,10.92 66.8,10.92 | U3.17 71.5,18.93 69.09,16.51 67.56,16.51 66.04,14.99 66.04,14.22 66.31,13.96 U3.4 66.31,11.42 66.8,10.92
N$16
  Top 0.254: QA2.11 97.03,24.64 95.57,26.1 RA3.19
N$17
  Top 0.254: QA1.13 83.19,25.27 84.71,26.8 92.2,26.8 92.39,26.99 RA3.14
N$18
  Top 0.61: U1.P$17 76.83,58.63 C4.2
N$19
  Top 0.305: R3.2 64.94,27.53 D3.C
N$20
  Top 0.305: R4.2 69,27.53 D4.C
N$21
  Top 0.305: R5.2 73.06,27.53 D5.C
N$22
  Top 0.305: U1.P$67 73.66,30.31 R5.1
N$23
  Top 0.305: U1.P$66 72.39,30.9 R4.1
N$24
  Top 0.305: U1.P$65 71.12,31.24 70.36,30.48 67.91,30.48 R3.1
N$25
  Top 0.254: QA1.11 85.72,25.15 86.87,26.29 92.33,26.29 93.03,26.99 RA3.15
N$26
  Top 0.254: QA1.9 88.27,25.15 88.9,25.78 92.46,25.78 93.66,26.99 RA3.16
N$27
  Top 0.254: RA3.24 99.38,27.18 107.19,27.18 109.09,25.27 110.62,25.27 111,24.89 QA3.9
N$28
  Top 0.254: QA3.15 103.38,25.15 102.87,25.73 98.12,25.73 96.84,26.99 RA3.21
N$29
  Top 0.254: QA3.13 105.92,25.15 104.78,26.16 98.3,26.16 97.47,26.99 RA3.22
N$30
  Top 0.254: QA3.11 108.46,25.15 106.93,26.67 98.42,26.67 98.11,26.99 RA3.23
N$31
  Top 0.254: Q1.1 117.16,14.33 R15.1
N$32
  Top 0.254: Q2.1 121.09,14.54 119.34,16.3 R16.1
N$33
  Top 0.254: QA1.15 80.64,25.27 82.8,27.3 91.76,27.3 RA3.13
N$34
  Top 0.254: QA2.15 91.95,24.64 94.3,26.99 RA3.17
N$37
  Top 0.254: QA2.9 99.57,24.51 98.81,25.27 97.92,25.27 96.2,26.99 RA3.20
N$38
  Top 0.254: U2.8 49.03,92.71 48.01,93.73 48.01,97.05 Y1.1
N$39  (via drill 0.41)
  Top 0.254: L2.1 C11.1 39.88,103.63 40.13,103.89 44.2,103.89 v44.96,103.12 | v48.26,103.89 47.78,104.36 J2.VCC
  Bottom 0.254: v44.96,103.12 47.5,103.12 v48.26,103.89
N$40
  Top 0.254: J2.D- 47.13,103.27 41.42,97.56 U4.16
N$41
  Top 0.254: J2.D+ 46.48,103.38 41.31,98.2 U4.15
N$43
  Top 0.254: U4.20 33.7,94.95 C19.A 34.8,96.4 C12.1 L2.2
N$44
  Top 0.254: U4.23 38.35,93 38.95,92.41 R6.1
N$45
  Top 0.254: U4.22 38.93,93.66 39.62,92.96 39.62,89.75 R7.1
N$46
  Top 0.254: D6.C 37.35,86.51 R6.2
N$47
  Top 0.254: D7.C 41.16,86.51 R7.2
N$50  (via drill 0.41 pad 0.41)
  Top 0.254: U2.57 55.63,96.26 56.13,95.76 56.13,93.47 55.63,92.96 53.34,92.96 v51.82,91.44 | v46.23,90.93 45.7,90.41 U4.2
  Bottom 0.254: v51.82,91.44 46.74,91.44 v46.23,90.93
N$51
  Top 0.254: C13.1 42.42,100.84 41.66,100.08 36.32,100.08 35.81,99.57 35.81,97.28 36.19,96.91 U4.17 38.73,96.91 40.89,94.74 40.89,92.71 | U4.4 41.9,91.7 40.89,92.71 | D6.A 38.86,84.33 39.88,83.31 42.16,83.31 42.66,83.81 D7.A 43.94,85.61 43.94,87.63 40.89,90.68 40.89,92.71
N$52
  Top 0.254: U2.9 48.76,92.21 47.52,93.45 Y1.2 47.92,99.46 R12.2
N$53
  Top 0.254: D9.C 70.33,84.06 R9.2
N$54
  Top 0.254: R11.2 60.49,84.16 60.07,84.58 56.9,84.58 56.13,85.35 U2.25
N$55
  Top 0.254: D10.C 66.01,84.06 R8.2
N$56
  Top 0.254: R9.1 69.43,81.15 61.98,81.15 60.07,83.06 54.23,83.06 53.59,83.69 53.59,84.07 54.1,84.58 54.1,86.63 U2.21
N$58
  Top 0.254: QA2.13 94.49,25.78 94.93,26.23 RA3.18
RADIO_SFD  (via drill 0.41)
  Top 0.254: U1.P$50 v54.36,35.56
  Bottom 0.254: v54.36,35.56 59.69,40.89 59.69,65.28 58.93,66.04 57.15,66.04 J3.4
RH
  pour Top: 4.32,96.01 2.54,94.23 2.54,53.34 5.08,53.34 5.08,87.38 7.87,90.42 17.53,90.42 17.53,97.79 6.35,97.79
RST  (via drill 0.41 pad 0.41)
  Top 0.254: S1.1 57.17,12.72 S3.P$4 S3.P$2 59.96,24.64 74.42,24.64 82.55,32.77 v82.55,39.37 | U1.P$16 78.49,53.34 v78.74,53.09
  Bottom 0.254: v78.74,53.09 79.25,53.09 83.31,49.02 83.31,40.13 v82.55,39.37
RST1  (via drill 0.41 pad 0.41)
  Top 0.254: 28.11,85.98 C14.1 28.11,97.45 S2.1 | 28.11,85.98 R27.2 | v33.27,89.92 32.62,89.26 S4.P$4 S4.P$2 32.62,84.73 31.62,85.72 28.36,85.72 28.11,85.98 | U2.58 v55.13,95.52
  Bottom 0.254: v33.27,89.92 40.39,89.92 45.97,95.5 55.12,95.5 v55.13,95.52
RST_USB  (via drill 0.41)
  Top 0.254: v63.25,11.68 65.28,11.68 65.66,12.06 U3.3
  Bottom 0.254: v63.25,11.68 58.42,11.68 54.61,7.87 S1.2
RST_USB1  (via drill 0.41 pad 0.41)
  Top 0.254: U4.3 43.05,91.06 v42.67,90.68 | v37.08,88.65 36.32,88.65 34.16,90.81 33.15,90.81 32.26,91.69 32.26,101.09 S2.2
  Bottom 0.254: v42.67,90.68 40.64,88.65 v37.08,88.65
STAR
  Top 1.422: RE6.A1 8.73,36.83 J15.1
STAR_PIN
  Top 0.254: U1.P$39 51.56,49.53 48.26,46.23 48.26,43 46.32,41.06 46.32,40.55 | TP10.TESTPOINT 46.32,37.21
  Top 0.61: RE6.COMMON2 36.9,41.66 45.21,41.66 46.32,40.55 C10.1 46.32,37.21 R22.1
  Top 1.422: RE6.COMMON2 RE6.COMMON1
TSTAT1_DOWN_IN  (via drill 0.41)
  Top 0.254: J18.3 127.64,40.01 127.64,34.92 124.46,31.75 119.89,31.75 118.72,30.58 U7.5 | v121.79,44.83 SA2.1
  Bottom 0.254: J18.3 126.62,44.83 v121.79,44.83
TSTAT1_DOWN_OUT
  Top 0.254: QA1.3 QA1.4 83.19,14.1 JP3.2 82.55,6.1 J20.3
TSTAT1_DOWN_OUT_CTRL  (via drill 0.41)
  Top 0.254: RA3.11 92.39,34.1 90.55,35.94 RA4.2 90.58,39.9 91.92,41.25 99.59,41.25 100.33,40.51 101.73,40.51 102.36,41.15 D12.P$2 v102.36,43.69 | v118.36,46.1 SA2.2
  Bottom 0.254: v102.36,43.69 103.5,42.55 112.39,42.55 115.95,46.1 v118.36,46.1
TSTAT1_DOWN_OUT_PIN
  Top 0.254: D12.P$1 105.31,47.77 U8.5
TSTAT1_ENTER_IN  (via drill 0.41)
  Top 0.254: J18.2 128.14,37.97 128.14,34.67 124.59,31.24 120.14,31.24 119.38,30.48 119.38,29.64 U7.4 | v116.2,40.01 116.2,41.91 115.44,42.67 SA3.8
  Bottom 0.254: J18.2 128.91,40.01 v116.2,40.01
TSTAT1_ENTER_OUT
  Top 0.254: QA1.1 QA1.2 80.64,14.1 JP3.1 80.01,6.1 J20.2
TSTAT1_ENTER_OUT_CTRL  (via drill 0.41)
  Top 0.254: RA3.12 91.76,33.85 89.28,36.32 RA4.1 89.31,40.16 90.83,41.68 100.44,41.68 D11.P$2 v100.58,43.18 | v112.9,41.4 SA3.9
  Bottom 0.254: v100.58,43.18 102.36,41.4 v112.9,41.4
TSTAT1_ENTER_OUT_PIN
  Top 0.254: D11.P$1 104.66,48.38 U8.4
TSTAT1_ESC_IN  (via drill 0.41)
  Top 0.254: J18.5 126.62,44.07 126.62,35.43 123.95,32.77 119.38,32.77 117.42,30.8 U7.7 | v115.95,48.64 SA2.11
  Bottom 0.254: J18.5 127.89,48.64 v115.95,48.64
TSTAT1_ESC_OUT
  Top 0.254: QA1.7 QA1.8 88.27,14.1 JP3.4 87.63,6.1 J20.5
TSTAT1_ESC_OUT_CTRL  (via drill 0.41)
  Top 0.254: RA3.9 93.66,34.61 93.09,35.18 RA4.4 93.12,39.4 94.11,40.39 99.19,40.39 100.58,38.99 103.76,38.99 105.92,41.15 D14.P$2 v105.92,44.7 | v113.16,49.91 SA2.10
  Bottom 0.254: v105.92,44.7 106.81,43.81 111.76,43.81 113.16,45.21 v113.16,49.91
TSTAT1_ESC_OUT_PIN
  Top 0.254: D14.P$1 106.61,46.52 U8.7
TSTAT1_HELP_IN  (via drill 0.41)
  Top 0.254: J18.4 127.13,42.04 127.13,35.18 124.21,32.26 119.63,32.26 118.07,30.69 U7.6 | v121.67,47.37 SA2.3
  Bottom 0.254: J18.4 126.62,47.37 v121.67,47.37
TSTAT1_HELP_OUT
  Top 0.254: QA1.5 QA1.6 85.72,14.1 JP3.3 85.09,6.1 J20.4
TSTAT1_HELP_OUT_CTRL  (via drill 0.41)
  Top 0.254: RA3.10 93.03,34.35 91.82,35.56 RA4.3 91.85,39.78 92.89,40.82 99.39,40.82 100.33,39.88 102.87,39.88 104.14,41.15 D13.P$2 v104.14,44.2 | v118.36,47.88 119.13,48.64 SA2.4
  Bottom 0.254: v104.14,44.2 105.16,43.18 112.01,43.18 116.71,47.88 v118.36,47.88
TSTAT1_HELP_OUT_PIN
  Top 0.254: D13.P$1 105.96,47.15 U8.6
TSTAT1_LCD_DB4
  Top 0.254: J16.4 83.57,106.68 JP2.11 91.38,98.87 RA1.7
TSTAT1_LCD_DB4_PIN
  Top 0.254: RA1.18 RA1.17 90.74,88.96 88.27,86.49 66.42,86.49 62.7,90.21 U2.36
TSTAT1_LCD_DB5
  Top 0.254: J16.5 81.03,106.68 JP2.10 90.11,97.6 RA1.9
TSTAT1_LCD_DB5_PIN
  Top 0.254: RA1.16 RA1.15 89.47,88.96 87.5,87 66.55,87 62.84,90.71 U2.37
TSTAT1_LCD_DB6
  Top 0.254: J16.6 78.49,106.68 JP2.9 87.88,97.28 88.14,97.28 88.84,96.58 RA1.11
TSTAT1_LCD_DB6_PIN
  Top 0.254: RA1.14 RA1.13 88.2,88.96 86.74,87.5 66.67,87.5 62.97,91.21 U2.38
TSTAT1_LCD_DB7
  Top 0.254: J16.7 75.95,106.68 JP2.8 83.57,96.97 RA2.1
TSTAT1_LCD_DB7_PIN
  Top 0.254: RA2.24 RA2.23 81.85,88.96 80.9,88.01 66.8,88.01 63.11,91.71 U2.39
TSTAT1_LCD_E
  Top 0.254: J16.3 86.11,106.68 JP2.12 92.65,97.98 RA1.5
TSTAT1_LCD_E_PIN  (via drill 0.41)
  Top 0.254: RA1.20 RA1.19 92.01,88.96 89.03,85.98 66.29,85.98 64.52,87.76 v63.88,87.76 | U2.15 52.88,89.21 54.1,90.42 v58.17,90.42
  Bottom 0.254: v63.88,87.76 61.85,87.76 59.18,90.42 v58.17,90.42
TSTAT1_LCD_R/W
  Top 0.254: J16.2 88.65,106.68 JP2.13 93.92,96.71 RA1.3
TSTAT1_LCD_R/W_PIN  (via drill 0.41)
  Top 0.254: RA1.22 RA1.21 93.28,88.96 89.79,85.47 66.17,85.47 64.9,86.74 v63.88,86.74 | U2.16 54.67,88.71 55.63,89.66 v57.28,89.66
  Bottom 0.254: v63.88,86.74 62.23,86.74 59.31,89.66 v57.28,89.66
TSTAT1_LCD_RS
  Top 0.254: J16.1 91.19,106.68 JP2.14 98.81,98.81 95.89,95.89 RA1.1
TSTAT1_LCD_RS_PIN  (via drill 0.41)
  Top 0.254: RA1.24 RA1.23 94.55,88.96 90.55,84.96 66.04,84.96 65.28,85.72 v63.88,85.72 | v56.39,88.9 55.75,88.27 52.7,88.27 52.13,87.69 U2.17
  Bottom 0.254: v63.88,85.72 62.48,85.72 59.31,88.9 v56.39,88.9
TSTAT1_MENU_IN  (via drill 0.41)
  Top 0.254: J18.7 125.6,48.13 125.6,35.94 123.44,33.78 116.84,33.78 114.82,31.76 U7.11 | v121.79,54.61 SA1.1
  Bottom 0.254: J18.7 127,54.61 v121.79,54.61
TSTAT1_MENU_OUT
  Top 0.254: QA2.4 QA2.3 93.22,13.97 JP3.6 92.71,6.1 J20.7
TSTAT1_MENU_OUT_CTRL  (via drill 0.41)
  Top 0.254: RA3.7 94.93,34.35 95.63,35.05 RA4.6 95.66,38.63 96.55,39.52 98.78,39.52 100.84,37.47 105.79,37.47 109.47,41.15 D16.P$2 v109.47,45.72 | v118.11,55.88 SA1.2
  Bottom 0.254: v109.47,45.72 109.98,45.21 111.63,45.21 112.01,45.59 112.01,46.74 111.63,47.12 111.63,53.98 113.54,55.88 v118.11,55.88
TSTAT1_MENU_OUT_PIN
  Top 0.254: D16.P$1 109.21,47.12 U8.11
TSTAT1_ON/OFF_IN
  Top 0.254: U7.12 114.17,31.87 116.59,34.29 123.19,34.29 125.09,36.2 125.09,50.16 J18.8 127,57.15 SA1.3
TSTAT1_ON/OFF_OUT
  Top 0.254: QA2.6 QA2.5 95.76,13.97 JP3.7 95.25,6.1 J20.8
TSTAT1_ON/OFF_OUT_CTRL  (via drill 0.41)
  Top 0.254: RA3.6 95.57,34.23 96.9,35.56 RA4.7 96.93,38.25 97.77,39.09 98.58,39.09 100.7,36.97 107.2,36.97 111.25,41.02 D17.P$2 v111.25,46.23 | v118.11,58.42 SA1.4
  Bottom 0.254: v118.11,58.42 116.08,56.39 113.28,56.39 111.12,54.23 111.12,46.35 v111.25,46.23
TSTAT1_ON/OFF_OUT_PIN
  Top 0.254: D17.P$1 109.86,48.75 U8.12
TSTAT1_SPEAKER_IN  (via drill 0.41)
  Top 0.254: SA1.10 113.41,59.69 112.39,60.71 112.39,68.2 117.35,73.15 v125.22,73.15
  Bottom 0.254: J12.2 v125.22,73.15
TSTAT1_SPEAKER_OUT
  Top 0.254: SA1.11 113.28,58.42 111.76,59.94 111.76,68.83 117.09,74.17 128.78,74.17 J12.1
TSTAT1_UP_IN  (via drill 0.41)
  Top 0.254: J18.6 126.11,46.1 126.11,35.69 123.7,33.27 116.97,33.27 115.47,31.78 U7.10 | v115.95,49.78 115.95,52.07 115.57,52.45 SA2.8
  Bottom 0.254: J18.6 129.29,49.78 v115.95,49.78
TSTAT1_UP_OUT
  Top 0.254: QA2.2 QA2.1 90.68,13.97 JP3.5 90.17,6.1 J20.6
TSTAT1_UP_OUT_CTRL  (via drill 0.41)
  Top 0.254: RA3.8 94.3,34.48 94.36,34.54 RA4.5 94.39,39.14 95.2,39.95 98.98,39.95 100.97,37.97 104.52,37.97 107.7,41.15 D15.P$2 v107.7,45.21 | v112.65,51.18 SA2.9
  Bottom 0.254: v107.7,45.21 108.46,44.45 111.63,44.45 112.65,45.47 112.65,49.28 112.27,49.66 112.27,50.8 v112.65,51.18
TSTAT1_UP_OUT_PIN
  Top 0.254: D15.P$1 108.56,47.2 U8.10
TSTAT2_DOWN_IN  (via drill 0.41)
  Top 0.254: U7.19 115.47,22.45 117.35,20.57 128.02,20.57 J19.3 | v111,33.27 110.49,32.77 110.49,30.99 109.98,30.48 SA4.3
  Bottom 0.254: J19.3 126.75,21.84 126.75,25.4 118.36,33.78 111.51,33.78 v111,33.27
TSTAT2_DOWN_OUT
  Top 0.254: QA3.2 QA3.1 102.11,15.24 JP3.9 100.33,11.68 J21.3
TSTAT2_DOWN_OUT_CTRL  (via drill 0.41)
  Top 0.254: RA3.4 96.84,32.32 96.65,32.13 91.44,32.13 90.93,32.64 90.93,33.78 89.92,34.8 v88.9,34.8 88.27,34.16 88.27,32.13 90.3,30.1 98.68,30.1 100.2,28.57 105.28,28.57 108.46,31.75 SA4.4 | RA4.15 v90.58,44.86 90.58,46.25 90.93,46.61 D23.P$2
  Bottom 0.254: v90.58,44.86 90.58,36.47 v88.9,34.8
TSTAT2_DOWN_OUT_PIN
  Top 0.254: U8.19 108.56,56.29 105.79,59.05 98.93,59.05 95.25,55.37 92.47,55.37 D23.P$1
TSTAT2_ENTER_IN  (via drill 0.41)
  Top 0.254: J19.2 125.98,20.07 116.84,20.07 114.81,22.1 114.81,24.21 U7.18 | v111.25,32.26 111.25,30.73 110.49,29.97 110.49,28.45 109.86,27.81 109.47,27.81 SA4.1
  Bottom 0.254: J19.2 126.24,19.81 126.24,25.15 118.11,33.27 112.27,33.27 v111.25,32.26
TSTAT2_ENTER_OUT
  Top 0.254: QA2.7 QA2.8 | 98.3,17.53 QA2.7 | QA2.7 98.3,13.97 JP3.8 97.79,11.68 J21.2
TSTAT2_ENTER_OUT_CTRL  (via drill 0.41)
  Top 0.254: RA3.5 96.2,33.97 98.17,35.94 RA4.8 98.91,37.49 v99.19,37.21 v102.11,34.29 | D24.P$2 v89.03,45.97 | v107.82,29.21 SA4.2
  Bottom 0.254: v89.03,45.97 94.74,45.97 95.5,45.21 95.5,38.1 96.14,37.47 98.93,37.47 v99.19,37.21 | v102.11,34.29 107.19,29.21 v107.82,29.21
TSTAT2_ENTER_OUT_PIN
  Top 0.254: U8.18 109.21,56.4 106.05,59.56 98.81,59.56 95.12,55.88 91.07,55.88 D24.P$1
TSTAT2_ESC_IN  (via drill 0.41)
  Top 0.254: J19.5 127,21.59 119.76,21.59 118.07,23.28 U7.23 | v105.41,34.29 105.41,35.05 104.9,35.56 SA4.8
  Bottom 0.254: J19.5 118.87,34.8 105.92,34.8 v105.41,34.29
TSTAT2_ESC_OUT
  Top 0.254: QA3.6 QA3.5 107.19,15.24 JP3.11 105.41,11.68 J21.5
TSTAT2_ESC_OUT_CTRL  (via drill 0.41)
  Top 0.254: RA3.2 98.11,31.69 | RA4.13 v93.12,44.86 93.12,44.98 94.74,46.61 D21.P$2 | 98.11,31.69 98.55,32.13 101.47,32.13 103.63,34.29 SA4.9 | 98.11,31.69 97.54,31.11 91.19,31.11 v89.53,32.77
  Bottom 0.254: v93.12,44.86 93.12,36.35 v89.53,32.77
TSTAT2_ESC_OUT_PIN
  Top 0.254: U8.23 105.96,56.47 104.39,58.04 99.44,58.04 95.24,53.84 D21.P$1
TSTAT2_HELP_IN  (via drill 0.41)
  Top 0.254: U7.20 116.12,22.82 117.86,21.08 129.03,21.08 J19.4 | v105.79,31.75 SA4.11
  Bottom 0.254: J19.4 127.25,23.88 127.25,25.65 118.62,34.29 106.43,34.29 105.79,33.66 v105.79,31.75
TSTAT2_HELP_OUT
  Top 0.254: QA3.4 QA3.3 104.65,15.24 JP3.10 102.87,11.68 J21.4
TSTAT2_HELP_OUT_CTRL  (via drill 0.41)
  Top 0.254: RA4.14 v91.85,44.86 91.85,45.62 92.84,46.61 D22.P$2 | SA4.10 103.12,33.02 101.6,31.5 98.55,31.5 97.66,30.61 90.42,30.61 88.77,32.26 88.77,33.15 v89.53,33.91 90.42,33.02 90.42,32.51 91.31,31.62 96.77,31.62 97.47,32.32 RA3.3
  Bottom 0.254: v91.85,44.86 91.85,36.22 v89.53,33.91
TSTAT2_HELP_OUT_PIN
  Top 0.254: U8.20 107.91,56.17 105.54,58.55 99.19,58.55 95.5,54.86 93.87,54.86 D22.P$1
TSTAT2_LCD_DB4
  Top 0.254: J17.4 64.77,104.39 68.07,104.39 JP2.4 75.21,97.26 76.99,97.26 77.41,96.84 RA2.9
TSTAT2_LCD_DB4_PIN
  Top 0.254: RA2.16 RA2.15 76.77,88.96 76.33,88.52 66.93,88.52 63.24,92.21 U2.40
TSTAT2_LCD_DB5
  Top 0.254: J17.5 62.74,103.89 66.04,103.89 JP2.3 73.1,96.85 76.02,96.85 76.14,96.71 RA2.11
TSTAT2_LCD_DB5_PIN
  Top 0.254: RA2.14 RA2.13 73.28,90.55 71.75,89.03 67.06,89.03 66.93,89.15 66.61,89.47 63.38,92.71 U2.41
TSTAT2_LCD_DB6
  Top 0.254: J17.6 60.71,103.38 64.01,103.38 JP2.2 70.1,97.26 71.37,97.26 71.94,96.71 RA6.1
TSTAT2_LCD_DB6_PIN
  Top 0.254: RA6.16 RA6.15 71.31,89.85 70.99,89.53 67.18,89.53 63.51,93.21 U2.42
TSTAT2_LCD_DB7
  Top 0.254: J17.7 58.67,102.87 61.98,102.87 JP2.1 68,96.85 70.41,96.85 70.67,96.58 RA6.3
TSTAT2_LCD_DB7_PIN
  Top 0.254: RA6.14 RA6.13 70.04,91.38 69.72,91.69 67.56,91.69 65.55,93.71 U2.43
TSTAT2_LCD_E
  Top 0.254: J17.3 66.8,104.9 70.1,104.9 JP2.5 76.07,99.06 77.98,97.16 78.49,97.16 78.68,96.97 RA2.7
TSTAT2_LCD_E_PIN  (via drill 0.41)
  Top 0.254: RA2.18 RA2.17 78.04,91.38 77.22,92.2 67.69,92.2 65.41,94.49 v63.75,94.49 | v59.05,91.19 54.1,91.19 52.62,89.71 U2.14
  Bottom 0.254: v63.75,94.49 60.2,90.93 59.31,90.93 v59.05,91.19
TSTAT2_LCD_R/W
  Top 0.254: J17.2 68.83,105.41 72.14,105.41 JP2.6 79.95,97.6 RA2.5
TSTAT2_LCD_R/W_PIN  (via drill 0.41)
  Top 0.254: RA2.20 RA2.19 79.31,91.63 78.23,92.71 67.82,92.71 65.02,95.5 v63.75,95.5 | v60.05,91.82 60.05,90.4 57.4,87.76 52.96,87.76 52.63,87.43 U2.18
  Bottom 0.254: v63.75,95.5 63.73,95.5 v60.05,91.82
TSTAT2_LCD_RS
  Top 0.254: J17.1 73.41,106.68 JP2.7 81.22,98.87 RA2.3
TSTAT2_LCD_RS_PIN  (via drill 0.41)
  Top 0.254: RA2.22 RA2.21 80.58,91.63 78.99,93.22 68.07,93.22 64.77,96.52 v63.75,96.52 | v58.67,92.2 53.59,92.2 52.1,90.71 U2.12
  Bottom 0.254: v58.67,92.2 59.44,92.2 v63.75,96.52
TSTAT2_MENU_IN  (via drill 0.41)
  Top 0.254: U7.25 119.37,23.51 120.27,22.61 125.09,22.61 126.75,24.26 126.75,26.42 J19.7 | v121.54,37.59 SA3.3
  Bottom 0.254: J19.7 127.89,30.86 127.89,32.51 122.81,37.59 v121.54,37.59
TSTAT2_MENU_OUT
  Top 0.254: JP3.13 110.49,12.57 111.46,11.6 Q1.3 116.2,5.97 J21.7
TSTAT2_MENU_OUT_CTRL  (via drill 0.41)
  Top 0.254: RA4.11 95.66,43.97 98.55,46.86 v98.55,47.88 D19.P$2 | v118.11,37.97 119,38.86 SA3.4 | v112.52,31.88 112.52,32.38 111.89,33.02 v111.89,39.37 | R15.2 v115.19,19.3
  Bottom 0.254: v98.55,47.88 98.55,42.93 102.11,39.37 v111.89,39.37 114.43,39.37 115.82,37.97 v118.11,37.97 | v115.19,19.3 115.19,29.46 112.78,31.88 v112.52,31.88
TSTAT2_MENU_OUT_PIN
  Top 0.254: D19.P$1 98.55,54.86 100.71,57.02 103.89,57.02 104.65,56.26 104.65,55.29 U8.25
TSTAT2_ON/OFF_IN  (via drill 0.41)
  Top 0.254: U7.26 120.02,23.49 120.4,23.11 124.71,23.11 126.24,24.64 126.24,28.45 J19.8 | v116.2,38.86 SA3.11
  Bottom 0.254: J19.8 122.43,38.86 v116.2,38.86
TSTAT2_ON/OFF_OUT
  Top 0.254: JP3.14 113.79,12.7 119.04,12.7 Q2.3 120.14,4.57 J21.8
TSTAT2_ON/OFF_OUT_CTRL  (via drill 0.41)
  Top 0.254: RA4.10 96.93,44.35 v100.46,47.88 D18.P$2 | SA3.10 v112.9,40.13 112.9,38.99 112.39,38.48 112.39,33.4 v113.28,32.51 | R16.2 v118.11,19.3
  Bottom 0.254: v100.46,47.88 99.69,47.12 99.69,42.8 102.36,40.13 v112.9,40.13 | v113.28,32.51 116.2,29.59 116.2,22.61 118.11,20.7 v118.11,19.3
TSTAT2_ON/OFF_OUT_PIN
  Top 0.254: D18.P$1 100.46,56.13 100.84,56.52 103.63,56.52 104.01,56.14 U8.26
TSTAT2_SPEAKER_IN
  Top 0.254: SA1.9 113.92,60.96 113.03,61.85 113.03,67.31 114.81,69.09 128.78,69.09 J13.2
TSTAT2_SPEAKER_OUT
  Top 0.254: J13.1 128.78,66.55 115.57,66.55 114.55,65.53 SA1.8
TSTAT2_UP_IN  (via drill 0.41)
  Top 0.254: U7.24 118.72,23.39 120.02,22.1 125.35,22.1 127.25,24 127.25,24.38 J19.6 | v121.54,35.05 SA3.1
  Bottom 0.254: J19.6 127.38,28.83 127.38,32.38 124.71,35.05 v121.54,35.05
TSTAT2_UP_OUT
  Top 0.254: QA3.8 QA3.7 109.73,15.24 JP3.12 107.95,11.68 J21.6
TSTAT2_UP_OUT_CTRL  (via drill 0.41)
  Top 0.254: RA4.12 v94.39,44.86 94.89,44.86 96.65,46.61 D20.P$2 | RA3.1 98.74,35.5 v99.19,35.94 | SA3.2 v118.11,36.32
  Bottom 0.254: v94.39,44.86 94.36,44.83 94.36,38.48 96.9,35.94 v99.19,35.94 99.57,36.32 v118.11,36.32
TSTAT2_UP_OUT_PIN
  Top 0.254: U8.24 105.28,55.3 105.28,56.39 104.14,57.53 100.58,57.53 96.89,53.84 D20.P$1
TSTAT_IN_I2C_INT  (via drill 0.41, 0.41 pad 0.41)  (1 unrouted)
  Top 0.254: v74.93,54.36 60.71,54.36 59.69,55.37 | v84.07,42.8 84.07,33.02 | 84.07,33.02 84.07,32.98 R24.2 | U7.14 111.85,29.62 v111.76,29.72 | 84.07,33.02 84.71,32.38 v85.85,32.38 86.74,33.27 TP3.TESTPOINT | U1.P$53 55.88,34.04 57.15,35.31 v57.15,54.61
  Bottom 0.254: v74.93,54.36 78.74,54.36 84.07,49.02 v84.07,42.8 | v111.76,29.72 110.49,28.45 90.42,28.45 86.49,32.38 v85.85,32.38 | v57.15,54.61 57.15,63.5
TSTAT_IN_I2C_RST  (via drill 0.41, 0.41 pad 0.41)
  Top 0.254: 76.2,35.56 U1.P$2 78.49,35.56 v78.74,35.31 | U7.3 120.02,28.71 119.76,28.45 111.89,28.45 v111.63,28.19 | R25.2 v81.28,34.67
  Bottom 0.254: 79.38,34.67 82.3,31.75 82.3,30.73 85.09,27.94 111.38,27.94 v111.63,28.19 | 79.38,34.67 v78.74,35.31 | v81.28,34.67 79.38,34.67
TSTAT_OUT_I2C_RST  (via drill 0.41 pad 0.41)
  Top 0.254: v81.28,42.04 86.61,47.37 86.61,52.83 | 86.61,52.83 R26.2 | U8.3 104.01,48.9 103.63,48.51 101.98,48.51 101.6,48.9 101.6,51.82 100.97,52.45 87,52.45 86.61,52.83 | U1.P$3 78.36,36.83 79.25,37.72 79.25,41.53 v78.74,42.04
  Bottom 0.254: v81.28,42.04 v78.74,42.04
VCC  (via drill 0.41, 0.41 pad 0.41)
  Top 0.254: D8.A 77.36,83.31 72.26,83.31 | 72.26,83.31 67.69,83.31 | 67.69,83.31 64.22,83.31 63.5,82.59 R11.1 | D9.A 73.03,82.55 72.26,83.31 | D10.A 67.94,83.06 67.69,83.31 | 52.13,99.72 C17.1 | R26.1 v86.61,61.34 | C15.1 112.87,20.65 | U7.2 120.67,28.43 v121.03,28.07 | 116.71,29.68 U7.8 | R25.1 80.56,37.93 80.01,38.48 | C16.1 116.37,58.59 115.57,57.78 113.28,57.78 112.39,56.9 | R24.1 84.58,29.59 84.33,29.34
  Top 0.356: 52.13,99.72 U2.64 52.13,96.58 51.76,96.21 U2.1 | 112.87,20.65 U7.15 112.87,24.98 113.41,25.53 | v117.35,22.86 116.77,23.44 U7.21 116.77,24.96 116.2,25.53 113.41,25.53 | SA1.14 113.79,53.85 107.57,53.85 107.26,54.16 | 107.26,54.16 U8.21 | 107.26,50.8 U8.8 U8.9 | 107.26,50.8 107.26,52.83 | 107.26,52.83 107.26,54.16 | U8.1 U8.2 103.36,51.67 104.14,52.45 106.88,52.45 107.26,52.83 | 107.26,50.8 107.89,51.44 111.12,51.44 112.01,50.55 112.01,46.74 113.92,44.83 SA2.14 111.76,42.04 111.76,40.77 111,40.01 v111,38.1 | 113.41,25.53 112.78,25.53 112.01,26.29 109.35,26.29 107.7,27.94 SA4.14 | U7.9 U7.8 | U7.2 U7.1 123.86,29.62 128.65,34.42 128.65,35.94 J18.1 | v116.71,30.99 116.71,29.68 | SA3.14 113.67,35.05 113.16,35.56 v113.16,38.1
  Top 0.406: C17.1 53.76,101.35 60.71,101.35 68.33,93.73 100.46,93.73 100.52,93.66 | SA4.14 100.08,27.94 98.68,29.34 84.33,29.34 82.21,29.34 v81.28,28.41
  Top 0.61: R19.2 v44.62,69.51 | R18.2 v44.62,59.86 v44.62,56.3 | R17.2 v44.62,46.9 v44.62,42.84 | 77.09,30.23 U1.P$68 | U1.P$37 53.59,52.07 54.61,53.09 | 54.61,53.09 U1.P$34 | 77.09,30.23 77.09,28.57 75.95,27.43 D5.A 74.66,26.66 73.91,25.91 71.12,25.91 70.61,26.42 | D4.A 70.6,26.94 70.61,26.92 70.61,26.42 | D3.A 66.54,26.43 67.06,25.91 | 67.06,25.91 70.1,25.91 70.61,26.42 | R22.2 v44.62,33.36 v44.62,29.55 | R21.2 v44.62,20.92 v44.62,16.6 | R20.2 v44.62,7.45 44.62,2.58 TP1.TESTPOINT | 77.09,30.23 v78.28,31.41 80.01,33.15 80.01,38.48 80.01,57.75 | 80.01,57.75 C4.1 | R13.1 87.54,75.35 v88.01,75.82 88.01,81.15 | R14.1 v80.61,75.35 80.01,74.75 v80.01,61.34 80.01,57.75 | J3.2 49.53,71.12 49.53,78.74 | 49.53,78.74 45.72,82.55 36.2,82.55 34.8,81.15 31.5,81.15 29.81,82.84 R27.1 | 49.53,78.74 53.34,74.93 JP1.1 | J11.2 100.58,104.9 | 100.58,104.9 97.03,104.9 J10.2 | SA1.14 113.54,54.61 112.39,55.75 112.39,56.9 107.95,61.34 v86.61,61.34 | 54.61,53.09 55.37,52.32 55.37,35.05 54.61,34.29 U1.P$51 v52.7,28.32 55.12,25.91 67.06,25.91 | U5.3 101.87,94.47 100.58,95.76 | 100.58,95.76 100.58,104.9 | 100.58,95.76 100.58,93.73 100.52,93.66 88.01,81.15 | D8.A 86.6,82.56 88.01,81.15
  Bottom 0.356: J19.1 120.65,22.86 | 120.65,22.86 v117.35,22.86 | v116.71,30.99 118.11,30.99 v121.03,28.07 121.03,23.24 120.65,22.86 | v113.16,38.1 v111,38.1
  Bottom 0.406: v78.28,31.41 v81.28,28.41
  Bottom 0.61: v44.62,59.86 v44.62,69.51 51.14,69.51 J3.2 | v44.62,56.3 v44.62,46.9 | v44.62,42.84 v44.62,33.36 | v44.62,20.92 v44.62,29.55 51.47,29.55 v52.7,28.32 | v44.62,16.6 v44.62,7.45 | v80.61,75.35 87.54,75.35 v88.01,75.82 | v86.61,61.34 v80.01,61.34
W1
  Top 1.422: J14.3 9.11,39.88 RE1.A1
W2
  Top 1.422: J15.3 3.81,15.33 RE4.A1
Y1
  Top 1.422: J14.2 11.43,50.04 11.43,55.4 RE2.A1
Y2
  Top 1.422: RE5.A1 9.4,22.95 9.4,31.24 6.35,34.29 J15.2

## Text on the board
tPlace: TSTAT2 | TSTAT1 | UART | DB7 | DB6 | DB5 | DB4 | E | R/W | RS | DB7 | DB6 | DB5 | DB4 | E | R/W | RS | 3V | GND | 3V | GND | 5V | GND | 5V | GND | PROG | 5.6V | GND | 5.6V | GND | RESET | TX | RX | NEST Interface Board | 24VAC SIGNALS | 2012/11/27 | TSTAT1 | SPEAKER_IN | VCC | GND | SPEAKER_OUT | 1 | TSTAT2 | LCD SNIFFER | MAIN CONTROLLER | SPEAKER_IN | 2 | SPEAKER_OUT | 1 | NEST | TSTAT1_IN | 24VAC | 1/0 | CMN | MENU | UP | ESC | G | HELP | Y1 | DOWN | W1 | ENTER | * | SHRT | Y2 | TSTAT2_IN | W2 | 1/0 | MENU | UP | ESC | HELP | RESET | DOWN | ENTER | SHRT | PROG | GND | ENTER | DOWN | HELP | ESC | UP | MENU | 1/0 | GND | ENTER | DOWN | HELP | ESC | UP | MENU | 1/0 | UART | 3V | GND | TX | RX | TSTAT1_OUT | TSTAT2_OUT